# Altium schematic sheet Light and Proximity Sensor.SchDoc: Ambient Light & Proximity Sensor
size A4; Date: Dec. 27th, 2022; Author: Karl Asseily; DrawnBy: Karl Asseily; DocumentNumber: 202301140903; Revision: 1.2; SheetNumber: 19; SheetTotal: 20
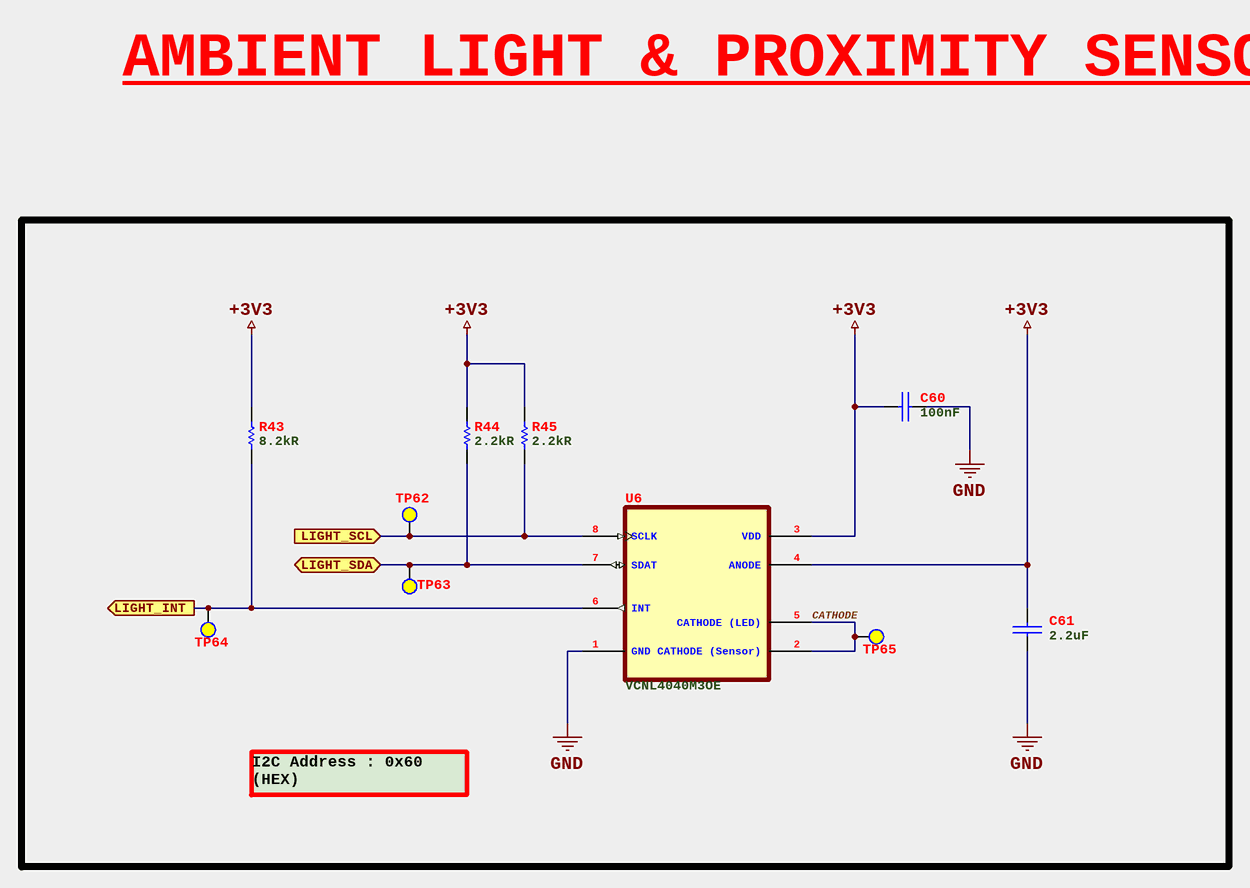
[diagram p0: Light and Proximity Sensor.SchDoc]

## Parts
C60  100nF  [CAP_0603]
C61  2.2uF  [CAP_0805]
R43  8.2kR  [RES_0603]
R44  2.2kR  [RES_0603]
R45  2.2kR  [RES_0603]
TP62  LIGHT_SCL  [TEST POINT PAD]  (value not drawn)  (no BOM)
TP63  LIGHT_SDA  [TEST POINT PAD]  (value not drawn)  (no BOM)
TP64  LIGHT_INT  [TEST POINT PAD]  (value not drawn)  (no BOM)
TP65  CATHODE  [TEST POINT PAD]  (value not drawn)  (no BOM)
U6  VCNL4040M3OE  [IC_VISHAY_VCNL4040_4X2X1.1]

## Ports
LIGHT_INT (out, see Cellar Watchdog, ESP32 Processor, Main Controller Unit), LIGHT_SCL (in, see Cellar Watchdog, ESP32 Processor, Main Controller Unit), LIGHT_SDA (bidir, see Cellar Watchdog, ESP32 Processor, Main Controller Unit)

## Nets
+3V3: C60.1 C61.1 R43.2 R44.2 R45.2 U6.3(VDD) U6.4(ANODE)
GND: C60.2 C61.2 U6.1(GND)
CATHODE: TP65.TP U6.2(CATHODE_(Sensor)) U6.5(CATHODE_(LED))
LIGHT_INT: R43.1 TP64.TP U6.6(INT) ; port LIGHT_INT
LIGHT_SCL: R45.1 TP62.TP U6.8(SCLK) ; port LIGHT_SCL
LIGHT_SDA: R44.1 TP63.TP U6.7(SDAT) ; port LIGHT_SDA

## Notes on the sheet
- AMBIENT LIGHT & PROXIMITY SENSOR
- I2C Address : 0x60 (HEX)
  0110 0000
- Project
- Sheet
- Size
- Filename
- A4
- of
- Number
- Drawn By
- Rev.
- Variant
- Date

## Library data of the parts
C60 = CAP_0.1uF-50V-10%_0603: 0.1 µF ±10% 50V Ceramic Capacitor X7R 0603 (1608 Metric); Manufacturer: Yageo; Manufacturer Part Number: CC0603KRX7R9BB104; Supplier 1: Digi-Key; RoHS: Yes; Category: Ceramic Capacitors; Stock 1: 10054527; Pricing 1: 1=0.10000, 10=0.05400, 50=0.02960, 100=0.02430, 500=0.01732, 1000=0.01361 (USD); Mounting Technology: Surface Mount; Case/Package: 0603; Pins: 2; Case Code (Metric): 1608; Case Code (Imperial): 0603; Dielectric Material: Ceramic; Min Operating Temperature: -55°C; Max Operating Temperature: 125°C; Package Quantity: 1; Capacitance: 100nF; Voltage Rating: 50V; Tolerance: 10%; Packaging: Tape and Reel; Dielectric: X7R; Termination: SMD/SMT; Voltage: 50V; Series: CC; Length: 0.063inch; Width: 0.031inch; Height: 0.8mm; Thickness: 0.035inch; Depth: 0.8mm; Radiation Hardening: No; Reach SVHC Compliant: Yes; Lead Free: Lead Free; Halogen Free: Halogen Free; RoHS Compliant: Yes; ComponentLink1URL: C:\Users\Public\Documents\Altium\Projects\Cellar_Watchdog\Docs\Capacitor\UPY-GPHC_X7R_6.3V-to-250V_22.pdf; ComponentLink1Description: Datasheet; Supplier Part Number 2: 603-CC603KRX7R9BB104; Supplier Part Number 1: 311-1344-1-ND; Supplier 2: Mouser
C61 = CAP_2.2uF-16V-10%_0805: 2.2 µF ±10% 16V Ceramic Capacitor X7R 0805 (2012 Metric); Manufacturer: Yageo; Manufacturer Part Number: CC0805KKX7R7BB225; Supplier 1: Digi-Key; RoHS: Yes; Category: Ceramic Capacitors; Stock 1: 121066; Pricing 1: 1=0.27000, 10=0.18700, 50=0.11240, 100=0.09500, 500=0.06500, 1000=0.05749 (USD); Mounting Technology: Surface Mount; Case/Package: 0805; Pins: 2; Case Code (Imperial): 0805; Case Code (Metric): 2012; Min Operating Temperature: -55°C; Max Operating Temperature: 125°C; Capacitance: 2.2uF; Tolerance: 10%; Dielectric: X7R; Voltage Rating: 16V; Voltage Rating (DC): 16V; Packaging: Tape and Reel; Termination: SMD/SMT; Resistor Type: Ceramic; Series: CC; Construction: Flat; Length: 2mm; Width: 0.049inch; Height: 1.25mm; Thickness: 0.057inch; Depth: 1.25mm; Radiation Hardening: No; Lead Free: Lead Free; Halogen Free: Halogen Free; RoHS Compliant: Yes; ComponentLink1URL: C:\Users\Public\Documents\Altium\Projects\Cellar_Watchdog\Docs\Capacitor\UPY-GPHC_X7R_6.3V-to-250V_22.pdf; ComponentLink1Description: Datasheet; Supplier 2: Mouser; Supplier Part Number 2: 603-CC805KKX7R7BB225; Supplier Part Number 1: 311-1881-1-ND
R43 = RES_8.2kR-100mW-1%_0603: 8.2 kOhms ±1% 0.1W, 1/10W Chip Resistor 0603 (1608 Metric) Moisture Resistant Thick Film; Manufacturer: Yageo; Manufacturer Part Number: RC0603FR-078K2L; Voltage Rating (DC): 50V; Temperature Coefficient: 100ppm/°C; Power Rating: 100mW; Supplier 1: Digi-Key; RoHS: Yes; Category: Chip SMD Resistors; Stock 1: 1009120; Pricing 1: 1=0.10000, 10=0.02100, 100=0.00850, 1000=0.00383, 2500=0.00332 (USD); Case/Package: 0603; Pins: 2; Case Code (Metric): 1608; Case Code (Imperial): 0603; Min Operating Temperature: -55°C; Max Operating Temperature: 155°C; Resistance: 8.2kR; Tolerance: 1%; Packaging: Tape and Reel; Resistor Type: Thick Film; Voltage Rating: 50V; Package Quantity: 1; Number of Terminations: 2; Termination: SMD/SMT; Max Power Dissipation: 100mW; Features: Moisture Resistant; Series: RC; Resistance Tolerance: 1%; Technology: THICK FILM; Construction: Rectangular; Length: 0.063inch; Width: 0.031inch; Height: 0.022inch; Depth: 0.8mm; Lead Pitch: 0.3mm; Reach SVHC Compliant: Yes; Lead Free: Lead Free; Military Standard: Not; RoHS Compliant: Yes; ComponentLink1URL: C:\Users\Public\Documents\Altium\Projects\Cellar_Watchdog\Docs\Resistor\PYu-RC_Group_51_RoHS_L_12.pdf; ComponentLink1Description: Datasheet; Supplier 2: Mouser; Supplier Part Number 2: 603-RC0603FR-078K2L; Supplier Part Number 1: 311-8.20KHRCT-ND
R44 R45 = RES_2.2kR-100mW-1%_0603: 2.2 kOhms ±1% 0.1W, 1/10W Chip Resistor 0603 (1608 Metric) Moisture Resistant Thick Film; Manufacturer: Yageo; Manufacturer Part Number: RC0603FR-072K2L; Temperature Coefficient: 100ppm/°C; Power Rating: 100mW; Voltage Rating: 50V; Supplier 1: Digi-Key; RoHS: Yes; Category: Chip SMD Resistors; Stock 1: 2856981; Pricing 1: 1=0.10000, 10=0.02100, 100=0.00850, 1000=0.00383, 2500=0.00332 (USD); Case/Package: 0603; Case Code (Imperial): 0603; Case Code (Metric): 1608; Min Operating Temperature: -55°C; Max Operating Temperature: 155°C; Resistance: 2.2kR; Tolerance: 1%; Packaging: Tape and Reel; Resistor Type: Thick Film; Package Quantity: 1; Termination: SMD/SMT; Number of Terminations: 2; Max Power Dissipation: 100mW; Features: Moisture Resistant; Series: RC; Resistance Tolerance: 1%; Construction: Rectangular; Length: 1.6mm; Width: 0.031inch; Height: 0.022inch; Depth: 0.8mm; Lead Free: Lead Free; Military Standard: Not; RoHS Compliant: Yes; Supplier 2: Mouser; ComponentLink1Description: Datasheet; ComponentLink1URL: C:\Users\Public\Documents\Altium\Projects\Cellar_Watchdog\Docs\Resistor\PYu-RC_Group_51_RoHS_L_12.pdf; Supplier Part Number 2: 603-RC0603FR-072K2L; Supplier Part Number 1: 311-2.20KHRCT-ND
TP62-TP65 = Test Point: PCB Test Point; ClassName: Test Point
  TP62: Value: LIGHT_SCL
  TP63: Value: LIGHT_SDA
  TP64: Value: LIGHT_INT
  TP65: Value: CATHODE
U6 = IC_VCNL4040M3OE: Optical Sensor Ambient 550nm I²C 8-SMD Module; Manufacturer: Vishay Semiconductors; Sensing Distance: 200mm; Min Supply Voltage (DC): 2.5V; Max Supply Voltage (DC): 3.6V; Output Current: 200mA; Output Type: I2C,Digital; Supplier 1: Digi-Key; Manufacturer Part Number: VCNL4040M3OE; RoHS: Yes; Category: Optical Sensors; Stock 1: 96939; Pricing 1: 1=2.91000, 5=2.75200, 10=2.36000, 25=1.88760, 50=1.73040, 100=1.57300, 500=1.37638, 1000=1.21908 (USD); Mount: Surface Mount; Case/Package: SMD/SMT; Number of Pins: 8; Min Operating Temperature: -40°C; Max Operating Temperature: 85°C; Packaging: Cut Tape; Wavelength: 550nm; Series: Filtron™; RoHS Compliant: Yes; Lead Free: Lead Free; ComponentLink2URL: C:\Users\Public\Documents\Altium\Projects\Cellar_Watchdog\Docs\Sensor\vcnl4040.pdf; ComponentLink2Description: Datasheet; Supplier 2: Mouser; Supplier Part Number 2: 78-VCNL4040M3OE; Supplier Part Number 1: VCNL4040M3OECT-ND